# Altium project Digital_Voltimeter_PCB.PrjPcb
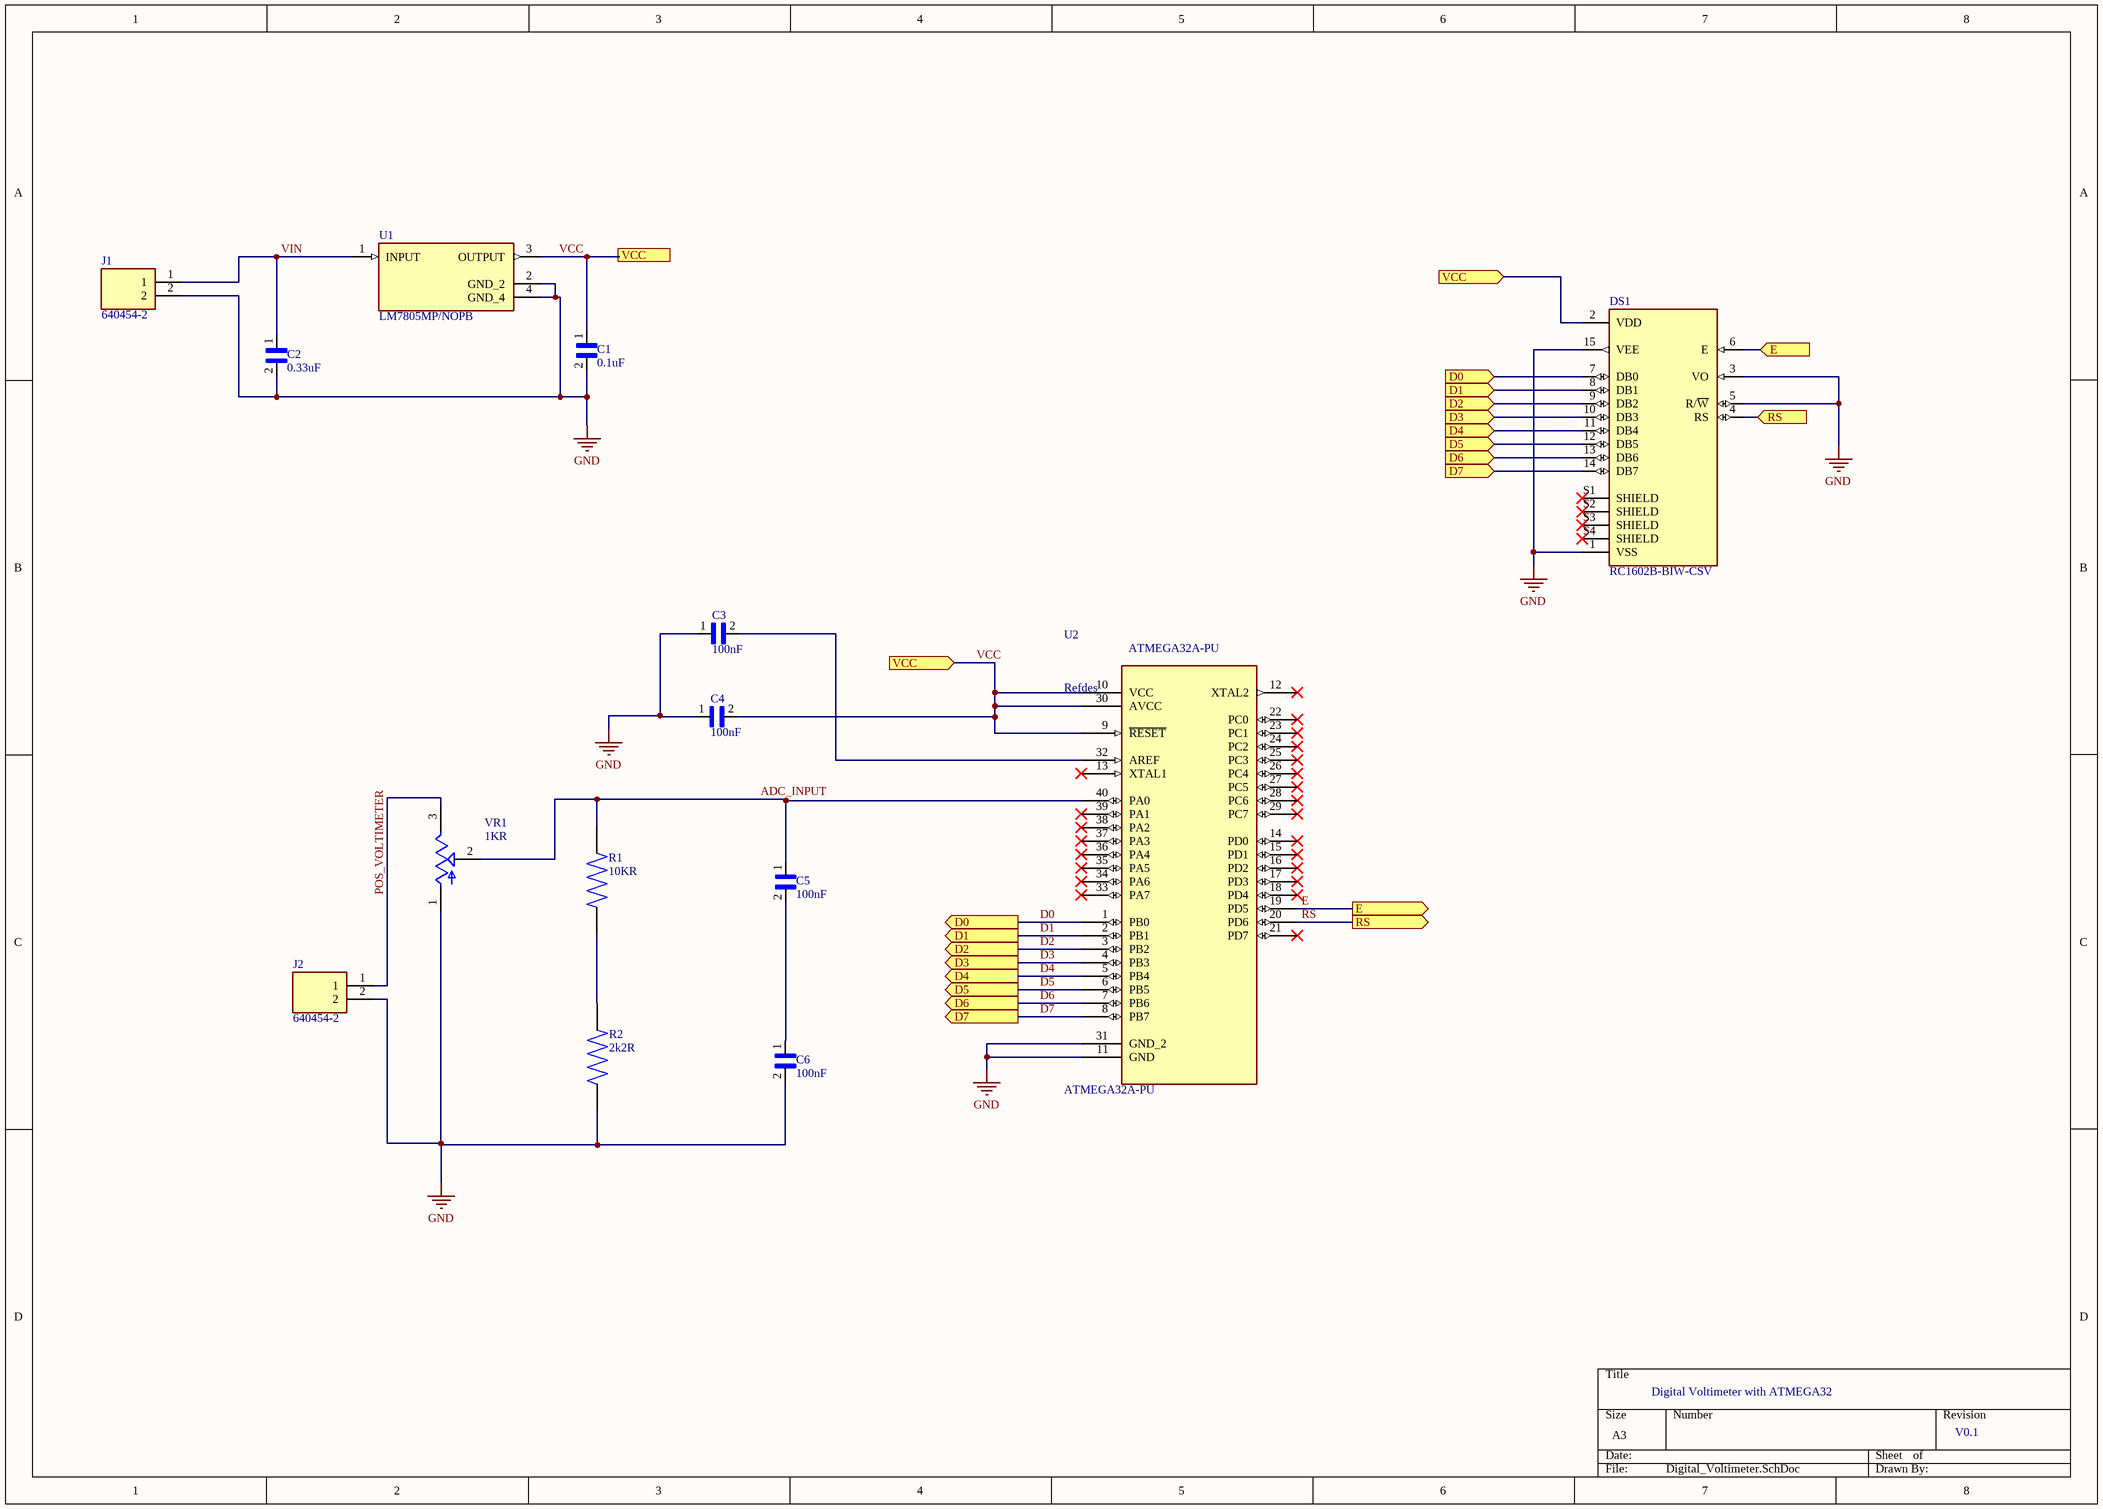
[diagram p0: Digital_Voltimeter.SchDoc]
1 sheet, 14 parts. Net scope: flat (ports and power ports of the same name join across sheets).
Board file: Digital_Voltimeter.PcbDoc

## Sheet Digital_Voltimeter.SchDoc
size A3

### Parts
C1  0.1uF  [CAPRR1500W60L1820T520H1540]
C2  0.33uF  [CAPRB250W50L550T350H600]
C3  100nF  [CAPC1608X90N]
C4  100nF  [CAPC1608X90N]
C5  100nF  [CAPC1608X90N]
C6  100nF  [CAPC1608X90N]
DS1  RC1602B-BIW-CSV  [LCD_RC1602B-BIW-CSV]
J1  640454-2  [TE_640454-2]
J2  640454-2  [TE_640454-2]
R1  10KR  [RESC3115X65N]
R2  2k2R  [RESC3126X65N]
U1  LM7805MP/NOPB  [VREG_LM7805MP/NOPB]
U2  ATMEGA32A-PU  [DIP254P1524X482-40]
VR1  1KR  [TRIM_3362P-1-253LF]

### Ports
D0 (in), D0 (out), D1 (in), D1 (out), D2 (in), D2 (out), D3 (in), D3 (out), D4 (in), D4 (out), D5 (in), D5 (out), D6 (in), D6 (out), D7 (in), D7 (out), E (in), E (out), RS (in), RS (out), VCC (in), VCC (out)

### Nets
GND: C1.2 C2.2 C3.1 C4.1 C6.2 DS1.1(VSS) DS1.3(VO) DS1.5(R/~{W}) DS1.15(VEE) J1.2 J2.2 R2.1 U1.2(GND_2) U1.4(GND_4) U2.11(GND) U2.31(GND_2) VR1.1(CCW)
ADC_INPUT: C5.1 R1.2 U2.40(PA0) VR1.2(WIPER)
D0: DS1.7(DB0) U2.1(PB0) ; port D0
D1: DS1.8(DB1) U2.2(PB1) ; port D1
D2: DS1.9(DB2) U2.3(PB2) ; port D2
D3: DS1.10(DB3) U2.4(PB3) ; port D3
D4: DS1.11(DB4) U2.5(PB4) ; port D4
D5: DS1.12(DB5) U2.6(PB5) ; port D5
D6: DS1.13(DB6) U2.7(PB6) ; port D6
D7: DS1.14(DB7) U2.8(PB7) ; port D7
E: DS1.6(E) U2.19(PD5) ; port E
POS_VOLTIMETER: J2.1 VR1.3(CW)
RS: DS1.4(RS) U2.20(PD6) ; port RS
VCC: C1.1 C4.2 DS1.2(VDD) U1.3(OUTPUT) U2.9(~{RESET}) U2.10(VCC) U2.30(AVCC) ; port VCC
VIN: C2.1 J1.1 U1.1(INPUT)
NetC3_2: C3.2 U2.32(AREF)
NetC5_2: C5.2 C6.1
NetR1_1: R1.1 R2.2

Not connected (* = marked no-connect by the designer): DS1 S1(SHIELD)* S2(SHIELD)* S3(SHIELD)* S4(SHIELD)*; U2 12(XTAL2)* 13(XTAL1)* 14(PD0)* 15(PD1)* 16(PD2)* 17(PD3)* 18(PD4)* 21(PD7)* 22(PC0)* 23(PC1)* 24(PC2)* 25(PC3)* 26(PC4)* 27(PC5)* 28(PC6)* 29(PC7)* 33(PA7)* 34(PA6)* 35(PA5)* 36(PA4)* 37(PA3)* 38(PA2)* 39(PA1)*

### Notes on the sheet
- Digital Voltimeter with ATMEGA32
- V0.1
- (in symbol ATMEGA32A-PU) Refdes

### Library data of the parts
C1 = ECWFA2J104JQ: Price: None; Availability: Unavailable; Package: None; MP: ECWFA2J104JQ; Value: *
C2 = FA16X8R2A334KRU00: 0.33 ÂµF Â±10% 100V Ceramic Capacitor X8R Radial; MF: TDK; Check_prices: https://www.snapeda.com/parts/FA16X8R2A334KRU00/TDK/view-part/?ref=eda; Package: Radial TDK; MP: FA16X8R2A334KRU00; Value: *; SnapEDA_Link: https://www.snapeda.com/parts/FA16X8R2A334KRU00/TDK/view-part/?ref=snap; Availability: In Stock; Purchase-URL: https://pricing.snapeda.com/search/part/FA16X8R2A334KRU00/?ref=eda; Price: None
C3-C6 = 0603YC104KAZ2A: CERAMIC CAPACITOR, 0.1UF, 16V, X7R, 10%, 0603, FULL REEL; Package: None; Price: None; Value: *; MP: 0603YC104KAZ2A; Availability: Unavailable
DS1 = RC1602B-BIW-CSV: Display: LCD; alphanumeric; STN Negative; 16x2; blue; LED; PIN: 16; MF: Raystar; Value: *; SnapEDA_Link: https://www.snapeda.com/parts/RC1602B-BIW-CSV/Raystar/view-part/?ref=snap; Availability: Not in stock; Price: None; Package: None; Check_prices: https://www.snapeda.com/parts/RC1602B-BIW-CSV/Raystar/view-part/?ref=eda; MP: RC1602B-BIW-CSV
J1 J2 = 640454-2: 02P MTA100 HDR ASSY SQ STR POL; MF: TE Connectivity; MP: 640454-2; Price: None; Purchase-URL: https://pricing.snapeda.com/search/part/640454-2/?ref=eda; Package: None; Check_prices: https://www.snapeda.com/parts/640454-2/TE+Connectivity+AMP+Connectors/view-part/?ref=eda; Value: *; Availability: In Stock; EU_RoHS_Compliance: Compliant; SnapEDA_Link: https://www.snapeda.com/parts/640454-2/TE+Connectivity+AMP+Connectors/view-part/?ref=snap
R1 = CRGCQ1206J10K: Fixed Resistor CRGCQ 1206 10K 5%; MF: TE Connectivity; DigiKey-Purchase-URL: https://snapeda.com/shop?store=DigiKey&id=3188341; Mouser-Purchase-URL: https://snapeda.com/shop?store=Mouser&id=3188341; Value: *; SnapEDA_Link: https://www.snapeda.com/parts/CRGCQ1206J10K/TE%20Connectivity/view-part/3188341/?ref=snap; Availability: Warning; Price: None; Package: 3115 TE Connectivity; MP: CRGCQ1206J10K
R2 = CRGCQ1210J2K2: Fixed Resistor CRGCQ 1210 2K2 5%; Package: None; Price: None; Value: *; MP: CRGCQ1210J2K2; Availability: Unavailable
U1 = LM7805MP/NOPB: 1.5-A, 30-V, linear voltage regulator; MF: Texas Instruments; SnapEDA_Link: https://www.snapeda.com/parts/LM7805MP/NOPB/Texas+Instruments/view-part/?ref=snap; Package: SOT-223-4 Texas Instruments; MP: LM7805MP/NOPB; Check_prices: https://www.snapeda.com/parts/LM7805MP/NOPB/Texas+Instruments/view-part/?ref=eda; Purchase-URL: https://pricing.snapeda.com/search/part/LM7805MP/NOPB/?ref=eda; Price: None; Value: *; Availability: In Stock
U2 = ATMEGA32A-PU: AVR AVRÂ® ATmega Microcontroller IC 8-Bit 16MHz 32KB (16K x 16) FLASH 40-PDIP; MF: Microchip; Price: None; Availability: In Stock; Package: PDIP-40 Microchip; MP: ATMEGA32A-PU; Value: *; SnapEDA_Link: https://www.snapeda.com/parts/ATMEGA32A-PU/Microchip/view-part/?ref=snap; Purchase-URL: https://pricing.snapeda.com/search/part/ATMEGA32A-PU/?ref=eda; Check_prices: https://www.snapeda.com/parts/ATMEGA32A-PU/Microchip/view-part/?ref=eda
VR1 = 3362P-1-253LF: 25 kOhms 0.5W, 1/2W PC Pins Through Hole Trimmer Potentiometer Cermet 1.0 Turn Top Adjustment; MF: Bourns; SnapEDA_Link: https://www.snapeda.com/parts/3362P-1-253LF/Bourns/view-part/?ref=snap; Price: None; Check_prices: https://www.snapeda.com/parts/3362P-1-253LF/Bourns/view-part/?ref=eda; Purchase-URL: https://pricing.snapeda.com/search/part/3362P-1-253LF/?ref=eda; MP: 3362P-1-253LF; Value: *; Availability: In Stock; Package: 3362P-1 Bourns Inc.